# Altium schematic sheet Electrotactile.SchDoc
size A3
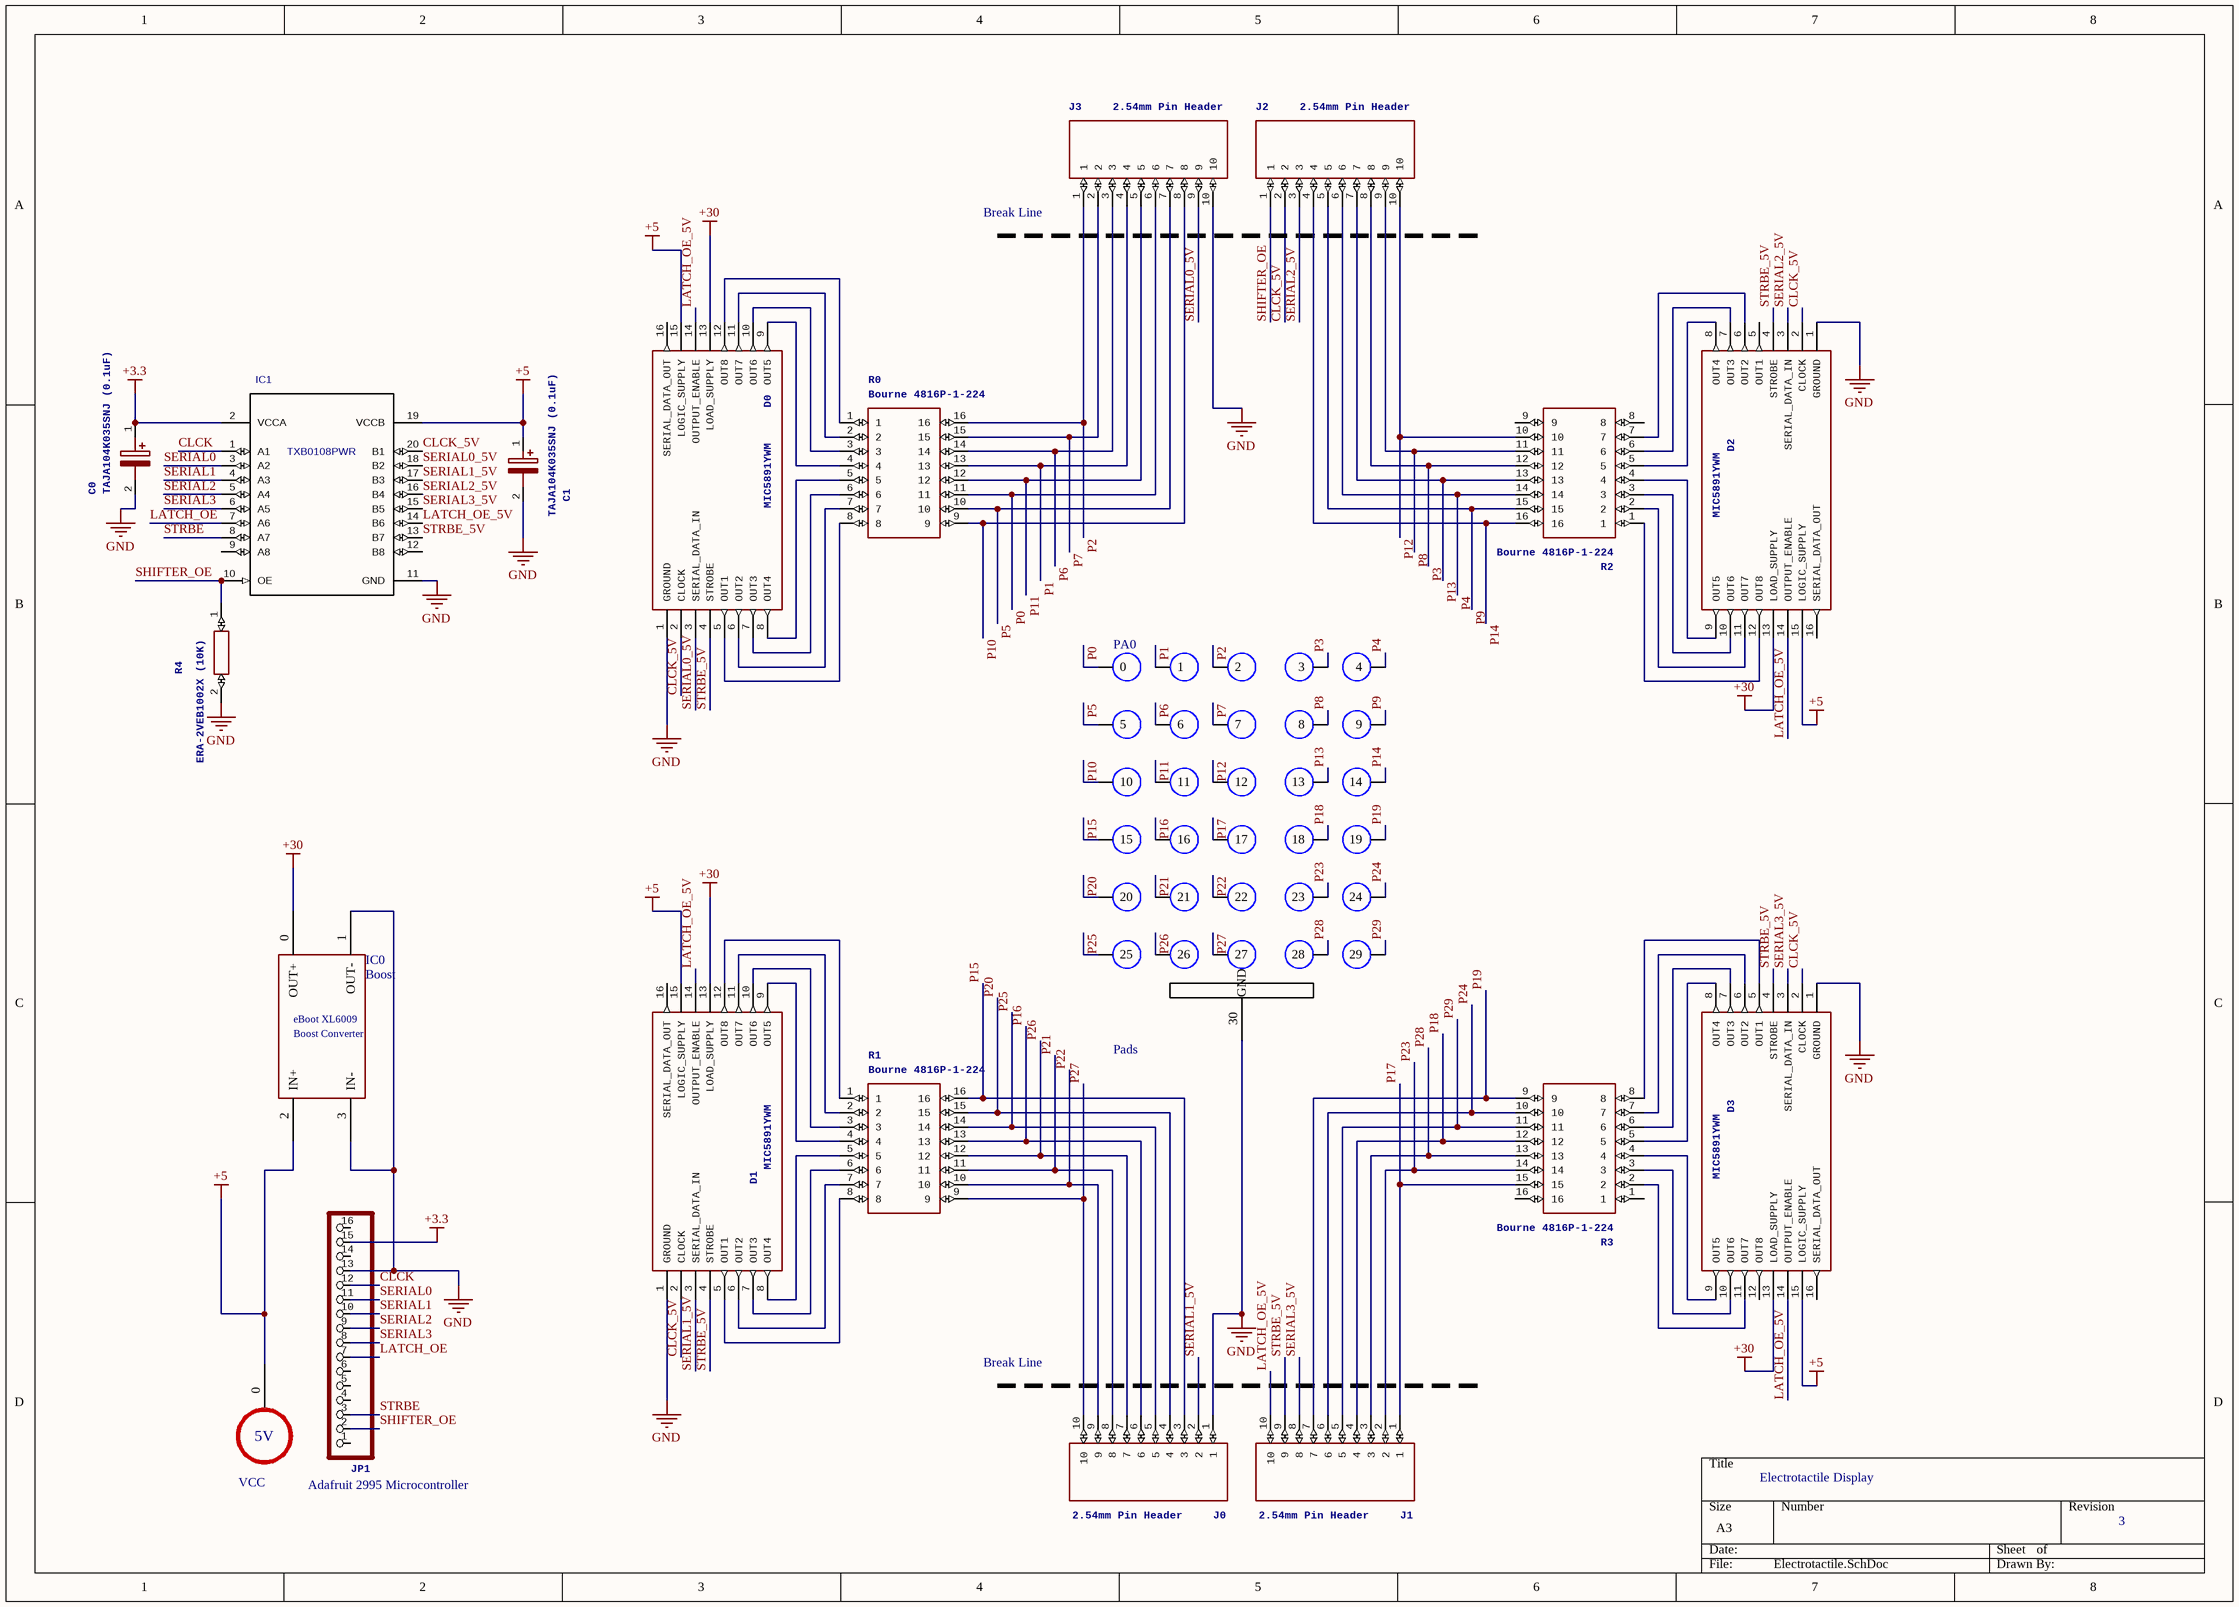
[diagram p0: Electrotactile.SchDoc]

## Parts
C0  TAJA104K035SNJ (0.1uF)  [CAPPM3216X180N]
C1  TAJA104K035SNJ (0.1uF)  [CAPPM3216X180N]
D0  MIC5891YWM  [SOIC127P1031X264-16N]
D1  MIC5891YWM  [SOIC127P1031X264-16N]
D2  MIC5891YWM  [SOIC127P1031X264-16N]
D3  MIC5891YWM  [SOIC127P1031X264-16N]
IC0  Boost  [Boost Pads]
IC1  TXB0108PWR  [SOP65P640X120-20N]
J0  2.54mm Pin Header  [HDRV10W64P0X254_1X10_2540X254X]
J1  2.54mm Pin Header  [HDRV10W64P0X254_1X10_2540X254X]
J2  2.54mm Pin Header  [HDRV10W64P0X254_1X10_2540X254X]
J3  2.54mm Pin Header  [HDRV10W64P0X254_1X10_2540X254X]
JP1  HEADER-1X16ROUND  [header_x16]  (value not drawn)
PA0  Pads  [Pads_Grid]
R0  Bourne 4816P-1-224  [SOIC127P762X215-16N]
R1  Bourne 4816P-1-224  [SOIC127P762X215-16N]
R2  Bourne 4816P-1-224  [SOIC127P762X215-16N]
R3  Bourne 4816P-1-224  [SOIC127P762X215-16N]
R4  ERA-2VEB1002X (10K)  [RESC1005X40N]
VCC  5V  [5v_Port]  (value not drawn)

## Nets
+3.3: C0.1(+) IC1.2(VCCA) JP1.15
+5: C1.1(+) D0.15(LOGIC_SUPPLY) D1.15(LOGIC_SUPPLY) D2.15(LOGIC_SUPPLY) D3.15(LOGIC_SUPPLY) IC0.2(IN+) IC1.19(VCCB) VCC.0
+30: D0.13(LOAD_SUPPLY) D1.13(LOAD_SUPPLY) D2.13(LOAD_SUPPLY) D3.13(LOAD_SUPPLY) IC0.0(OUT+)
GND: C0.2(-) C1.2(-) D0.1(GROUND) D1.1(GROUND) D2.1(GROUND) D3.1(GROUND) IC0.1(OUT-) IC0.3(IN-) IC1.11(GND) J0.1 J3.10 JP1.13 PA0.30(GND) R4.2
CLCK: IC1.1(A1) JP1.12
CLCK_5V: D0.2(CLOCK) D1.2(CLOCK) D2.2(CLOCK) D3.2(CLOCK) IC1.20(B1) J2.2
LATCH_OE: IC1.7(A6) JP1.7
LATCH_OE_5V: D0.14(OUTPUT_ENABLE) D1.14(OUTPUT_ENABLE) D2.14(OUTPUT_ENABLE) D3.14(OUTPUT_ENABLE) IC1.14(B6) J1.10
P0: J3.6 PA0.0 R0.11
P1: J3.4 PA0.1 R0.13
P2: J3.1 PA0.2 R0.16
P3: J2.8 PA0.3 R2.12
P4: J2.6 PA0.4 R2.14
P5: J3.7 PA0.5 R0.10
P6: J3.3 PA0.6 R0.14
P7: J3.2 PA0.7 R0.15
P8: J2.9 PA0.8 R2.11
P9: J2.5 PA0.9 R2.15
P10: J3.8 PA0.10 R0.9
P11: J3.5 PA0.11 R0.12
P12: J2.10 PA0.12 R2.10
P13: J2.7 PA0.13 R2.13
P14: J2.4 PA0.14 R2.16
P15: J0.3 PA0.15 R1.16
P16: J0.6 PA0.16 R1.13
P17: J1.1 PA0.17 R3.15
P18: J1.4 PA0.18 R3.12
P19: J1.7 PA0.19 R3.9
P20: J0.4 PA0.20 R1.15
P21: J0.8 PA0.21 R1.11
P22: J0.9 PA0.22 R1.10
P23: J1.2 PA0.23 R3.14
P24: J1.6 PA0.24 R3.10
P25: J0.5 PA0.25 R1.14
P26: J0.7 PA0.26 R1.12
P27: J0.10 PA0.27 R1.9
P28: J1.3 PA0.28 R3.13
P29: J1.5 PA0.29 R3.11
SERIAL0: IC1.3(A2) JP1.11
SERIAL0_5V: D0.3(SERIAL_DATA_IN) IC1.18(B2) J3.9
SERIAL1: IC1.4(A3) JP1.10
SERIAL1_5V: D1.3(SERIAL_DATA_IN) IC1.17(B3) J0.2
SERIAL2: IC1.5(A4) JP1.9
SERIAL2_5V: D2.3(SERIAL_DATA_IN) IC1.16(B4) J2.3
SERIAL3: IC1.6(A5) JP1.8
SERIAL3_5V: D3.3(SERIAL_DATA_IN) IC1.15(B5) J1.8
SHIFTER_OE: IC1.10(OE) J2.1 JP1.2 R4.1
STRBE: IC1.8(A7) JP1.3
STRBE_5V: D0.4(STROBE) D1.4(STROBE) D2.4(STROBE) D3.4(STROBE) IC1.13(B7) J1.9
NetD0_5: D0.5(OUT1) R0.8
NetD0_6: D0.6(OUT2) R0.7
NetD0_7: D0.7(OUT3) R0.6
NetD0_8: D0.8(OUT4) R0.5
NetD0_9: D0.9(OUT5) R0.4
NetD0_10: D0.10(OUT6) R0.3
NetD0_11: D0.11(OUT7) R0.2
NetD0_12: D0.12(OUT8) R0.1
NetD1_5: D1.5(OUT1) R1.8
NetD1_6: D1.6(OUT2) R1.7
NetD1_7: D1.7(OUT3) R1.6
NetD1_8: D1.8(OUT4) R1.5
NetD1_9: D1.9(OUT5) R1.4
NetD1_10: D1.10(OUT6) R1.3
NetD1_11: D1.11(OUT7) R1.2
NetD1_12: D1.12(OUT8) R1.1
NetD2_6: D2.6(OUT2) R2.7
NetD2_7: D2.7(OUT3) R2.6
NetD2_8: D2.8(OUT4) R2.5
NetD2_9: D2.9(OUT5) R2.4
NetD2_10: D2.10(OUT6) R2.3
NetD2_11: D2.11(OUT7) R2.2
NetD2_12: D2.12(OUT8) R2.1
NetD3_5: D3.5(OUT1) R3.8
NetD3_6: D3.6(OUT2) R3.7
NetD3_7: D3.7(OUT3) R3.6
NetD3_8: D3.8(OUT4) R3.5
NetD3_9: D3.9(OUT5) R3.4
NetD3_10: D3.10(OUT6) R3.3
NetD3_11: D3.11(OUT7) R3.2

Not connected (* = marked no-connect by the designer): D0 16(SERIAL_DATA_OUT); D1 16(SERIAL_DATA_OUT); D2 5(OUT1) 16(SERIAL_DATA_OUT); D3 12(OUT8) 16(SERIAL_DATA_OUT); IC1 9(A8) 12(B8); JP1 1 4 5 6 14 16; R2 8 9; R3 1 16

## Notes on the sheet
- (near J3) Break Line
- Break Line
- (near JP1) Adafruit 2995 Microcontroller
- Electrotactile Display
- 3
- (in symbol Boost) eBoot XL6009; Boost Converter

## Library data of the parts
C0 C1 = TAJA104K035SNJ: Manufacturer_Name: AVX; GateName_1: G$1; SymbolName_1: TAJA104K035SNJ; LibraryName: TAJA104K035SNJ; DeviceSetName: TAJA104K035SNJ; Mouser_Part_Number: 581-TAJA104K035SNJ; Mouser_Price-Stock: https://www.mouser.co.uk/ProductDetail/AVX/TAJA104K035SNJ?qs=0%252BYwpxhRXZhtcvceHRBYuQ%3D%3D; Manufacturer_Part_Number: TAJA104K035SNJ; Height: 1.8mm
D0-D3 = MIC5891YWM: Manufacturer_Name: Microchip; GateName_1: G$1; SymbolName_1: MIC5891YWM; LibraryName: MIC5891YWM; DeviceSetName: MIC5891YWM; Mouser_Part_Number: 998-MIC5891YWM; Mouser_Price-Stock: https://www.mouser.com/Search/Refine.aspx?Keyword=998-MIC5891YWM; Manufacturer_Part_Number: MIC5891YWM; Height: 2.64mm
IC1 = TXB0108PWR: Manufacturer: Texas Instruments; PartNumber: TXB0108PWR; Value: Value
J0-J3 = 61301011121: Manufacturer_Name: Wurth Elektronik; GateName_1: G$1; SymbolName_1: 61301011121; LibraryName: 61301011121; DeviceSetName: 61301011121; Mouser_Part_Number: 710-61301011121; Mouser_Price-Stock: https://www.mouser.co.uk/ProductDetail/Wurth-Elektronik/61301011121?qs=ZtY9WdtwX548wETl0P4xpA%3D%3D; Manufacturer_Part_Number: 61301011121; Height: 8.54mm
JP1 = HEADER-1X16ROUND: PIN HEADER; GateName_1: A; SymbolName_1: PINHD16; DeviceName: ROUND; LibraryName: microbuilder; DeviceSetName: HEADER-1X16
R0-R3 = 4816P-1-223LF: Manufacturer_Name: Bourns; GateName_1: G$1; SymbolName_1: 4816P-1-223LF; LibraryName: 4816P-1-223LF; DeviceSetName: 4816P-1-223LF; Mouser_Part_Number: 652-4816P-1LF-22K; Mouser_Price-Stock: https://www.mouser.co.uk/ProductDetail/Bourns/4816P-1-223LF?qs=yksRZAkH7guQI1U0uopZyw%3D%3D; Manufacturer_Part_Number: 4816P-1-223LF; Height: 2.15mm
R4 = ERA-2VEB1002X: Manufacturer_Name: Panasonic; GateName_1: G$1; SymbolName_1: ERA-2VEB1002X; LibraryName: ERA-2VEB1002X; DeviceSetName: ERA-2VEB1002X; Mouser_Part_Number: 667-ERA-2VEB1002X; Mouser_Price-Stock: https://www.mouser.co.uk/ProductDetail/Panasonic/ERA-2VEB1002X?qs=OlC7AqGiEDkeCq2k6HXliw%3D%3D; Manufacturer_Part_Number: ERA-2VEB1002X; Height: 0.4mm
VCC = Component_1